# EAGLE design FinalSchematic1.2 (EAGLE 9.6.2)

## Sheet 1 of 6: Microcontroller
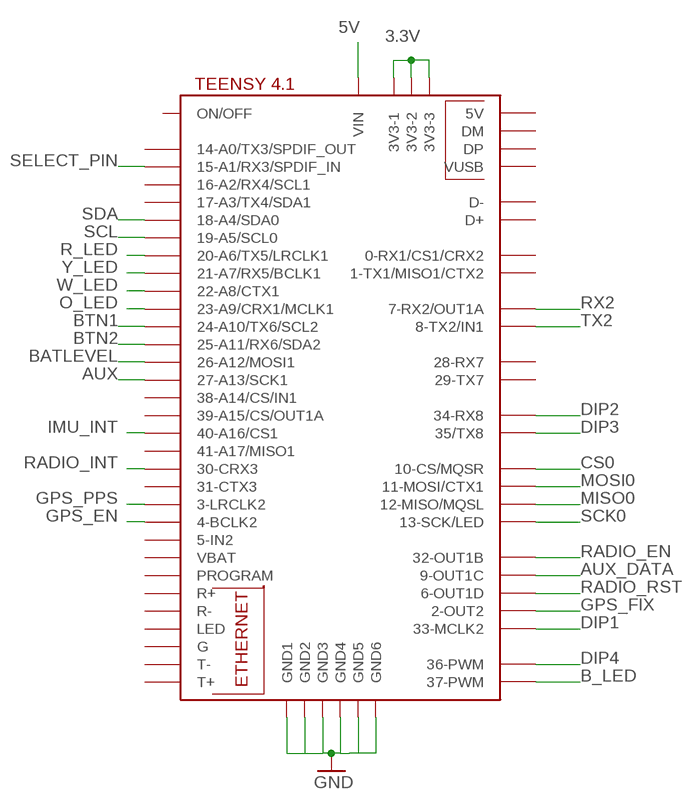
[diagram p0: schematic, sheet 1]

### Parts
TEENSY4.1  TEENSY41  [TEENSY41]

### Nets
3.3V: TEENSY4.1.3V3-1 TEENSY4.1.3V3-2 TEENSY4.1.3V3-3 ; also sheet 3
5V: TEENSY4.1.VIN ; also sheet 2,3,4,5,6
AUX: TEENSY4.1.27-A13/SCK1 ; also sheet 5
AUX_DATA: TEENSY4.1.9-OUT1C
B_LED: TEENSY4.1.37-PWM ; also sheet 5
BATLEVEL: TEENSY4.1.26-A12/MOSI1 ; also sheet 3
BTN1: TEENSY4.1.24-A10/TX6/SCL2 ; also sheet 5
BTN2: TEENSY4.1.25-A11/RX6/SDA2 ; also sheet 5
CS0: TEENSY4.1.10-CS\MQSR(10-CS/MQSR) ; also sheet 4
DIP1: TEENSY4.1.33-MCLK2 ; also sheet 5
DIP2: TEENSY4.1.34-RX8 ; also sheet 5
DIP3: TEENSY4.1.35-TX8(35/TX8) ; also sheet 5
DIP4: TEENSY4.1.36-PWM ; also sheet 5
GND: TEENSY4.1.GND1 TEENSY4.1.GND2 TEENSY4.1.GND3 TEENSY4.1.GND4 TEENSY4.1.GND5 TEENSY4.1.GND6 ; also sheet 2,3,4,5
GPS_EN: TEENSY4.1.4-BCLK2 ; also sheet 4
GPS_FIX: TEENSY4.1.2-OUT2 ; also sheet 4
GPS_PPS: TEENSY4.1.3-LRCLK2 ; also sheet 4
IMU_INT: TEENSY4.1.40-A16/CS1 ; also sheet 4
MISO0: TEENSY4.1.12-MISO/MQSL ; also sheet 4
MOSI0: TEENSY4.1.11-MOSI/CTX1 ; also sheet 4
O_LED: TEENSY4.1.23-A9/CRX1/MCLK1 ; also sheet 5
R_LED: TEENSY4.1.20-A6/TX5/LRCLK1 ; also sheet 5
RADIO_EN: TEENSY4.1.32-OUT1B ; also sheet 4
RADIO_INT: TEENSY4.1.30-CRX3 ; also sheet 4
RADIO_RST: TEENSY4.1.6-OUT1D ; also sheet 4
RX2: TEENSY4.1.7-RX2/OUT1A ; also sheet 4
SCK0: TEENSY4.1.13-SCK/LED ; also sheet 4
SCL: TEENSY4.1.19-A5/SCL0 ; also sheet 2,4,5,6
SDA: TEENSY4.1.18-A4/SDA0 ; also sheet 2,4,5,6
SELECT_PIN: TEENSY4.1.15-A1/RX3/SPDIF_IN ; also sheet 5
TX2: TEENSY4.1.8-TX2/IN1 ; also sheet 4
W_LED: TEENSY4.1.22-A8/CTX1 ; also sheet 5
Y_LED: TEENSY4.1.21-A7/RX5/BCLK1 ; also sheet 5
Unconnected: TEENSY4.1.0-RX1/CS1/CRX2 TEENSY4.1.1-TX1/MISO1/CTX2 TEENSY4.1.5-IN2 TEENSY4.1.14-A0/TX3/SPDIF_OUT TEENSY4.1.16-A2/RX4/SCL1 TEENSY4.1.17-A3/TX4/SDA1 TEENSY4.1.28-RX7 TEENSY4.1.29-TX7 TEENSY4.1.31-CTX3 TEENSY4.1.38-A14/CS/IN1 TEENSY4.1.39-A15/CS/OUT1A TEENSY4.1.41-A17/MISO1 TEENSY4.1.+5V(5V) TEENSY4.1.D+ TEENSY4.1.D- TEENSY4.1.DM TEENSY4.1.DP TEENSY4.1.G TEENSY4.1.LED TEENSY4.1.ON/OFF TEENSY4.1.PROGRAM TEENSY4.1.R+ TEENSY4.1.R- TEENSY4.1.T+ TEENSY4.1.T- TEENSY4.1.VBAT TEENSY4.1.VUSB

## Sheet 2 of 6: Servo Driver
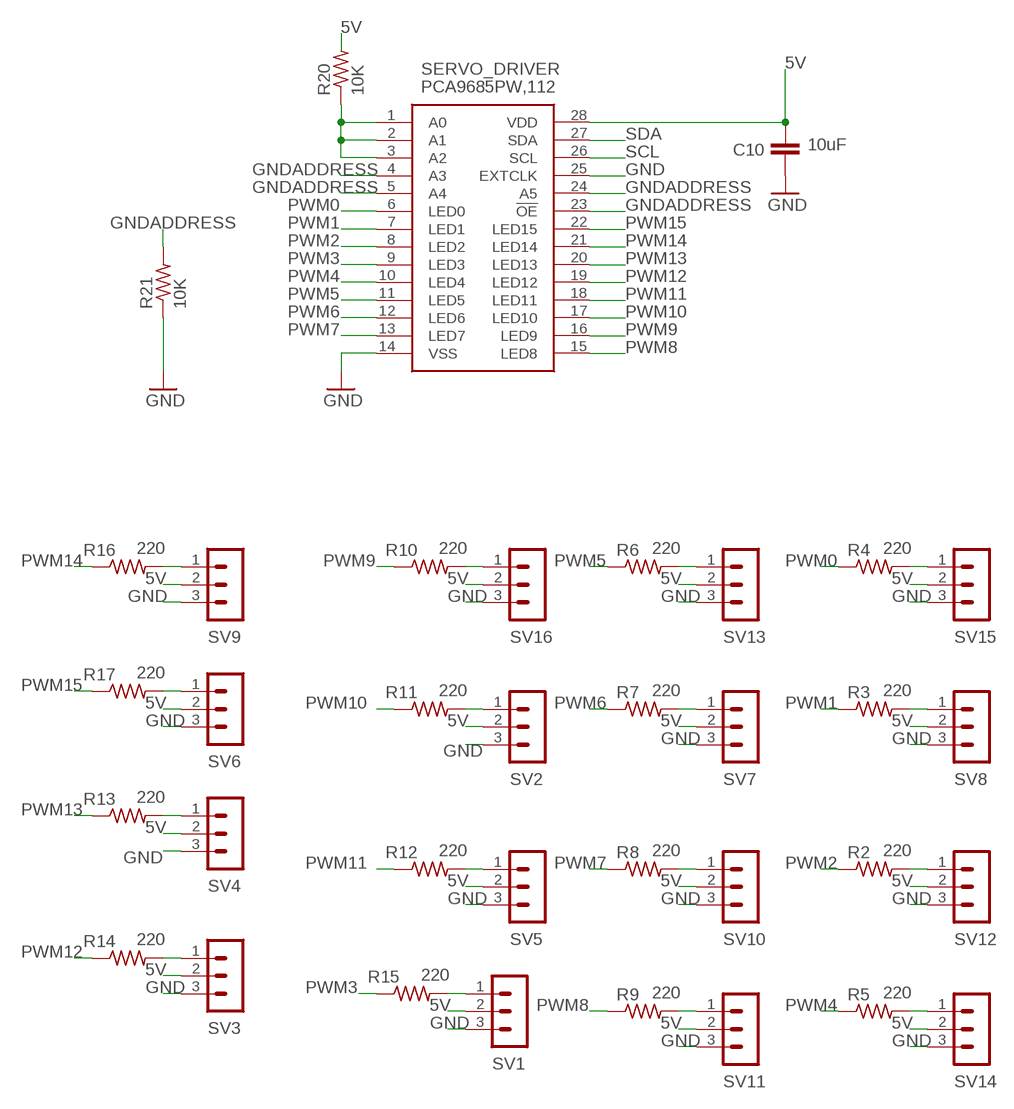
[diagram p1: schematic, sheet 2]

### Parts
C10  10uF  C2,5-3  [C2.5-3]
R2  220  R-US_0204/7  [0204/7]
R3  220  R-US_0204/7  [0204/7]
R4  220  R-US_0204/7  [0204/7]
R5  220  R-US_0204/7  [0204/7]
R6  220  R-US_0204/7  [0204/7]
R7  220  R-US_0204/7  [0204/7]
R8  220  R-US_0204/7  [0204/7]
R9  220  R-US_0204/7  [0204/7]
R10  220  R-US_0204/7  [0204/7]
R11  220  R-US_0204/7  [0204/7]
R12  220  R-US_0204/7  [0204/7]
R13  220  R-US_0204/7  [0204/7]
R14  220  R-US_0204/7  [0204/7]
R15  220  R-US_0204/7  [0204/7]
R16  220  R-US_0204/7  [0204/7]
R17  220  R-US_0204/7  [0204/7]
R20  10K  R-US_0204/7  [0204/7]
R21  10K  R-US_0204/7  [0204/7]
SERVO_DRIVER  PCA9685PW,112  [SOP65P640X110-28N]
SV1  MA03-1  [MA03-1]
SV2  MA03-1  [MA03-1]
SV3  MA03-1  [MA03-1]
SV4  MA03-1  [MA03-1]
SV5  MA03-1  [MA03-1]
SV6  MA03-1  [MA03-1]
SV7  MA03-1  [MA03-1]
SV8  MA03-1  [MA03-1]
SV9  MA03-1  [MA03-1]
SV10  MA03-1  [MA03-1]
SV11  MA03-1  [MA03-1]
SV12  MA03-1  [MA03-1]
SV13  MA03-1  [MA03-1]
SV14  MA03-1  [MA03-1]
SV15  MA03-1  [MA03-1]
SV16  MA03-1  [MA03-1]

### Nets
5V: C10.1 R20.2 SERVO_DRIVER.28(VDD) SV1.2 SV2.2 SV3.2 SV4.2 SV5.2 SV6.2 SV7.2 SV8.2 SV9.2 SV10.2 SV11.2 SV12.2 SV13.2 SV14.2 SV15.2 SV16.2 ; also sheet 1,3,4,5,6
GND: C10.2 R21.1 SERVO_DRIVER.14(VSS) SERVO_DRIVER.25(EXTCLK) SV1.3 SV2.3 SV3.3 SV4.3 SV5.3 SV6.3 SV7.3 SV8.3 SV9.3 SV10.3 SV11.3 SV12.3 SV13.3 SV14.3 SV15.3 SV16.3 ; also sheet 1,3,4,5
GNDADDRESS: R21.2 SERVO_DRIVER.4(A3) SERVO_DRIVER.5(A4) SERVO_DRIVER.23(!OE) SERVO_DRIVER.24(A5)
N$1: R20.1 SERVO_DRIVER.1(A0) SERVO_DRIVER.2(A1) SERVO_DRIVER.3(A2)
N$2: R14.2 SV3.1
N$43: R10.2 SV16.1
N$81: R6.2 SV13.1
N$82: R4.2 SV15.1
N$85: R3.2 SV8.1
N$88: R7.2 SV7.1
N$91: R11.2 SV2.1
N$94: R15.2 SV1.1
N$97: R2.2 SV12.1
N$100: R5.2 SV14.1
N$105: R9.2 SV11.1
N$108: R8.2 SV10.1
N$109: R12.2 SV5.1
N$112: R16.2 SV9.1
N$115: R17.2 SV6.1
N$118: R13.2 SV4.1
PWM0: R4.1 SERVO_DRIVER.6(LED0)
PWM1: R3.1 SERVO_DRIVER.7(LED1)
PWM2: R2.1 SERVO_DRIVER.8(LED2)
PWM3: R15.1 SERVO_DRIVER.9(LED3)
PWM4: R5.1 SERVO_DRIVER.10(LED4)
PWM5: R6.1 SERVO_DRIVER.11(LED5)
PWM6: R7.1 SERVO_DRIVER.12(LED6)
PWM7: R8.1 SERVO_DRIVER.13(LED7)
PWM8: R9.1 SERVO_DRIVER.15(LED8)
PWM9: R10.1 SERVO_DRIVER.16(LED9)
PWM10: R11.1 SERVO_DRIVER.17(LED10)
PWM11: R12.1 SERVO_DRIVER.18(LED11)
PWM12: R14.1 SERVO_DRIVER.19(LED12)
PWM13: R13.1 SERVO_DRIVER.20(LED13)
PWM14: R16.1 SERVO_DRIVER.21(LED14)
PWM15: R17.1 SERVO_DRIVER.22(LED15)
SCL: SERVO_DRIVER.26(SCL) ; also sheet 1,4,5,6
SDA: SERVO_DRIVER.27(SDA) ; also sheet 1,4,5,6

## Sheet 3 of 6: Voltage regulation
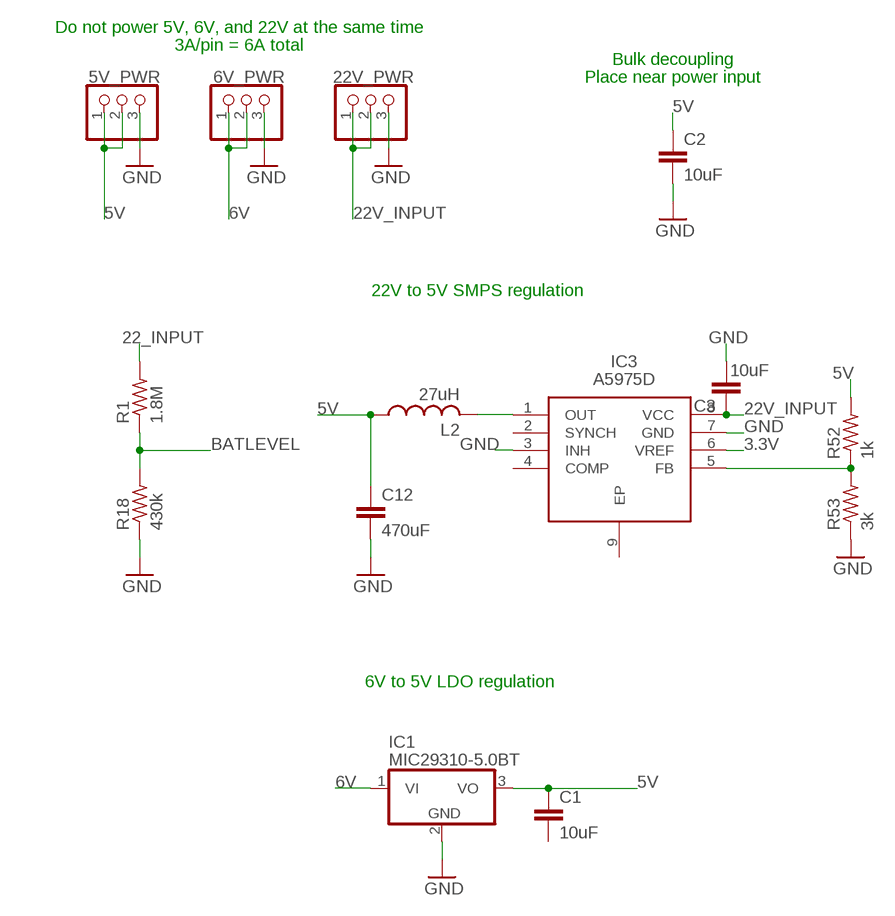
[diagram p2: schematic, sheet 3]

### Parts
5V_PWR  PINHD-1X3  [1X03]
6V_PWR  PINHD-1X3  [1X03]
22V_PWR  PINHD-1X3  [1X03]
C1  10uF  C2,5-3  [C2.5-3]
C2  10uF  C2,5-3  [C2.5-3]
C3  10uF  C2,5-3  [C2.5-3]
C12  470uF  C2,5-3  [C2.5-3]
IC1  MIC29310-5.0BT  786TV  [TO220V]
IC3  A5975D  [SOIC127P600X170-9N]
L2  27uH  L-USTFI0307  [TFI0307]
R1  1.8M  R-US_0204/7  [0204/7]
R18  430k  R-US_0204/7  [0204/7]
R52  1k  R-US_0204/7  [0204/7]
R53  3k  R-US_0204/7  [0204/7]

### Nets
3.3V: IC3.6(VREF) ; also sheet 1
5V: 5V_PWR.1 5V_PWR.2 C1.1 C2.1 C12.1 IC1.3(VO) L2.1 R52.2 ; also sheet 1,2,4,5,6
6V: 6V_PWR.1 6V_PWR.2 IC1.1(VI) ; also sheet 6
22_INPUT: R1.2
22V_INPUT: 22V_PWR.1 22V_PWR.2 C3.1 IC3.8(VCC) ; also sheet 6
BATLEVEL: R1.1 R18.2 ; also sheet 1
GND: 5V_PWR.3 6V_PWR.3 22V_PWR.3 C2.2 C3.2 C12.2 IC1.2(GND) IC3.3(INH) IC3.7(GND) R18.1 R53.1 ; also sheet 1,2,4,5
N$6: IC3.1(OUT) L2.2
N$18: IC3.5(FB) R52.1 R53.2
Unconnected: C1.2 IC3.2(SYNCH) IC3.4(COMP) IC3.9(EP)

### Notes on the sheet
- Do not power 5V, 6V, and 22V at the same time
- 3A/pin = 6A total
- Bulk decoupling
- Place near power input
- 22V to 5V SMPS regulation
- 6V to 5V LDO regulation

## Sheet 4 of 6: Sensors
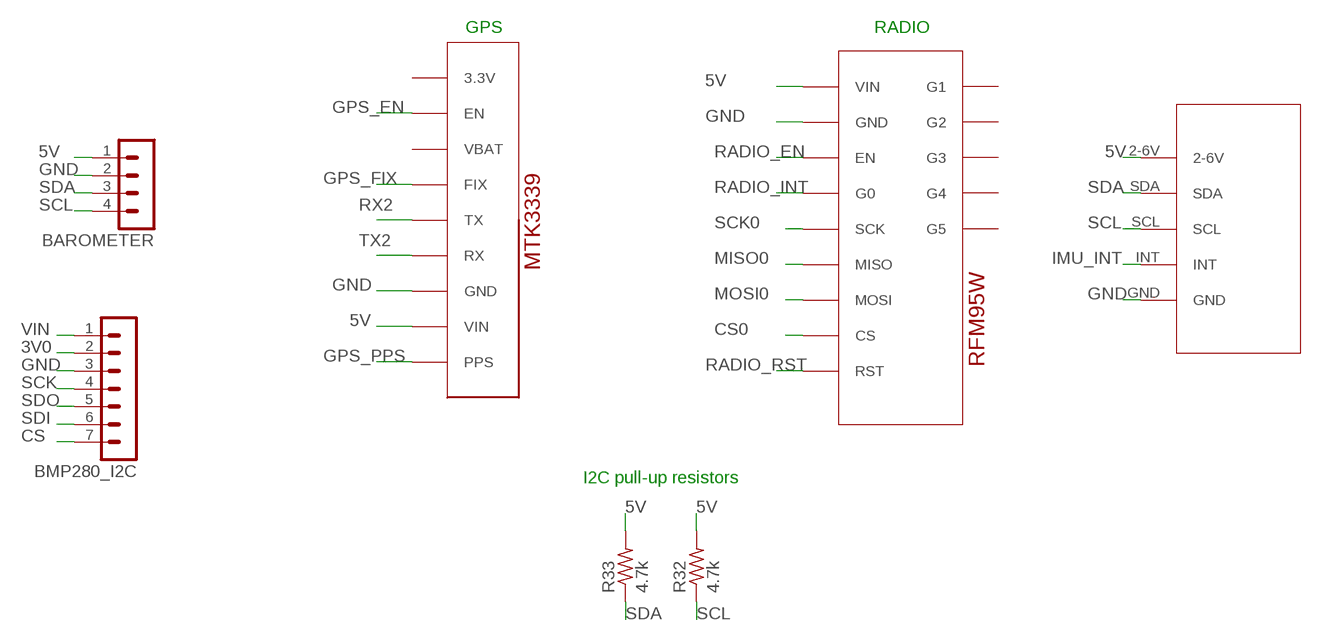
[diagram p3: schematic, sheet 4]

### Parts
BAROMETER  MA04-1  [MA04-1]
BMP280_I2C  MA07-1  [MA07-1]
GPSMTK3339  ADAFRUIT_MTK3339_GPS  [ADAFRUIT_MTK3339_GPS]
IMU  ICM20948BREAKOUTDEVICE  [ICM20948BREAKOUT]
R32  4.7k  R-US_0204/7  [0204/7]
R33  4.7k  R-US_0204/7  [0204/7]
RADIO  ADAFRUIT_RFM95W_LORA_RADIO  [ADAFRUIT_RFM95W_LORA_RADIO]

### Nets
3V0: BMP280_I2C.2
5V: BAROMETER.1 GPSMTK3339.VIN IMU.2-6V R32.2 R33.2 RADIO.1(VIN) ; also sheet 1,2,3,5,6
CS: BMP280_I2C.7
CS0: RADIO.8(CS) ; also sheet 1
GND: BAROMETER.2 BMP280_I2C.3 GPSMTK3339.GND IMU.GND RADIO.2(GND) ; also sheet 1,2,3,5
GPS_EN: GPSMTK3339.EN ; also sheet 1
GPS_FIX: GPSMTK3339.FIX ; also sheet 1
GPS_PPS: GPSMTK3339.PPS ; also sheet 1
IMU_INT: IMU.INT ; also sheet 1
MISO0: RADIO.6(MISO) ; also sheet 1
MOSI0: RADIO.7(MOSI) ; also sheet 1
RADIO_EN: RADIO.3(EN) ; also sheet 1
RADIO_INT: RADIO.4(G0) ; also sheet 1
RADIO_RST: RADIO.9(RST) ; also sheet 1
RX2: GPSMTK3339.TX ; also sheet 1
SCK: BMP280_I2C.4
SCK0: RADIO.5(SCK) ; also sheet 1
SCL: BAROMETER.4 IMU.SCL R32.1 ; also sheet 1,2,5,6
SDA: BAROMETER.3 IMU.SDA R33.1 ; also sheet 1,2,5,6
SDI: BMP280_I2C.6
SDO: BMP280_I2C.5
TX2: GPSMTK3339.RX ; also sheet 1
VIN: BMP280_I2C.1
Unconnected: GPSMTK3339.3.3V GPSMTK3339.VBAT RADIO.10(G1) RADIO.11(G2) RADIO.12(G3) RADIO.13(G4) RADIO.14(G5)

### Notes on the sheet
- GPS | RADIO
- I2C pull-up resistors

## Sheet 5 of 6: External Connectors
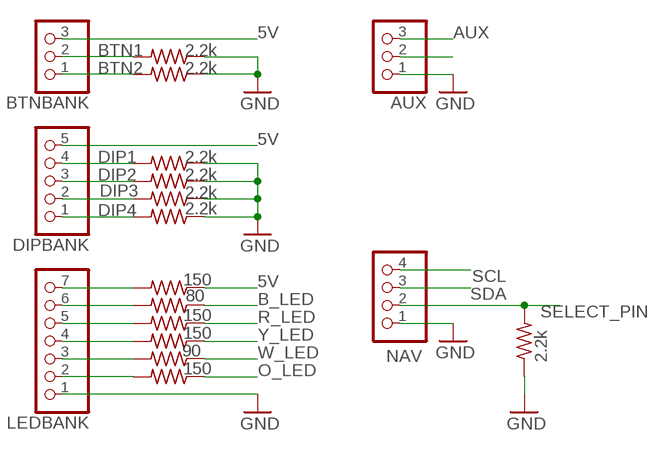
[diagram p4: schematic, sheet 5]

### Parts
AUX  PINHD-1X3  [1X03]
BLUE  80  R-US_0204/7  [0204/7]
BTNBANK  PINHD-1X3  [1X03]
DIPBANK  PINHD-1X5  [1X05]
GREEN  150  R-US_0204/7  [0204/7]
LEDBANK  PINHD-1X7  [1X07]
NAV  PINHD-1X4  [1X04]
ORANGE  150  R-US_0204/7  [0204/7]
R19  2.2k  R-US_0204/7  [0204/7]
R22  2.2k  R-US_0204/7  [0204/7]
R23  2.2k  R-US_0204/7  [0204/7]
R34  2.2k  R-US_0204/7  [0204/7]
R35  2.2k  R-US_0204/7  [0204/7]
R36  2.2k  R-US_0204/7  [0204/7]
R37  2.2k  R-US_0204/7  [0204/7]
RED  150  R-US_0204/7  [0204/7]
WHITE  90  R-US_0204/7  [0204/7]
YELLOW  150  R-US_0204/7  [0204/7]

### Nets
5V: BTNBANK.3 DIPBANK.5 GREEN.1 ; also sheet 1,2,3,4,6
AUX: AUX.3 ; also sheet 1
B_LED: BLUE.1 ; also sheet 1
BLUE: BLUE.2 LEDBANK.6
BTN1: BTNBANK.2 R19.2 ; also sheet 1
BTN2: BTNBANK.1 R22.2 ; also sheet 1
DIP1: DIPBANK.4 R37.2 ; also sheet 1
DIP2: DIPBANK.3 R36.2 ; also sheet 1
DIP3: DIPBANK.2 R34.2 ; also sheet 1
DIP4: DIPBANK.1 R35.2 ; also sheet 1
GND: AUX.1 LEDBANK.1 NAV.1 R19.1 R22.1 R23.1 R34.1 R35.1 R36.1 R37.1 ; also sheet 1,2,3,4
GREEN: GREEN.2 LEDBANK.7
N$4: AUX.2
O_LED: ORANGE.1 ; also sheet 1
ORANGE: LEDBANK.2 ORANGE.2
R_LED: RED.1 ; also sheet 1
RED: LEDBANK.5 RED.2
SCL: NAV.4 ; also sheet 1,2,4,6
SDA: NAV.3 ; also sheet 1,2,4,6
SELECT_PIN: NAV.2 R23.2 ; also sheet 1
W_LED: WHITE.1 ; also sheet 1
WHITE: LEDBANK.3 WHITE.2
Y_LED: YELLOW.1 ; also sheet 1
YELLOW: LEDBANK.4 YELLOW.2

## Sheet 6 of 6: Test Points
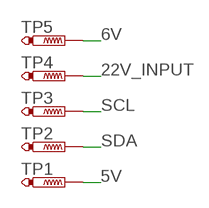
[diagram p5: schematic, sheet 6]

### Parts
TP1  PTR1B1,27  [B1,27]
TP2  PTR1B1,27  [B1,27]
TP3  PTR1B1,27  [B1,27]
TP4  PTR1B1,27  [B1,27]
TP5  PTR1B1,27  [B1,27]

### Nets
5V: TP1.TP ; also sheet 1,2,3,4,5
6V: TP5.TP ; also sheet 3
22V_INPUT: TP4.TP ; also sheet 3
SCL: TP3.TP ; also sheet 1,2,4,5
SDA: TP2.TP ; also sheet 1,2,4,5

## Library data of the parts
5V_PWR 6V_PWR 22V_PWR AUX BTNBANK = pinhead:PINHD-1X3: PIN HEADER
BAROMETER = con-lstb:MA04-1: PIN HEADER; OC_FARNELL: unknown; OC_NEWARK: unknown
BLUE GREEN ORANGE R1-R23 R32-R37 R52 R53 RED WHITE YELLOW = adafruit:R-US_: RESISTOR, American symbol
BMP280_I2C = con-lstb:MA07-1: PIN HEADER; OC_FARNELL: unknown; OC_NEWARK: unknown
C1-C3 C10 C12 = capacitor-wima:C: CAPACITOR naming: grid - package width
DIPBANK = pinhead:PINHD-1X5: PIN HEADER
GPSMTK3339 = AERO_Eagle_Library:ADAFRUIT_MTK3339_GPS: Adafruit's Ultimate GPS Breakout: MTK3339 https://www.adafruit.com/product/746
IC1 = linear:78*: Positive VOLTAGE REGULATOR Source: http://cache.national.com/ds/LM/LM78L05.pdf http://www.fairchildsemi.com/ds/LM/LM7805.pdf
IC3 = A5975D:A5975D: STMICROELECTRONICS - A5975D - DC/DC Boost Regulator, Adjustable, AEC-Q100, 4V to 36V In, 1.235V to 35V/3A Out, 250 kHz, PowerSO-8 Source: Datasheet <https://www.st.com/resource/en/datasheet/a5975d.pdf>; ARROW_PART_NUMBER: A5975D; ARROW_PRICE-STOCK: https://www.arrow.com/en/products/a5975d/stmicroelectronics; DESCRIPTION: STMICROELECTRONICS - A5975D - DC/DC Boost Regulator, Adjustable, AEC-Q100, 4V to 36V In, 1.235V to 35V/3A Out, 250 kHz, PowerSO-8; HEIGHT: 1.7mm; MANUFACTURER_NAME: STMicroelectronics; MANUFACTURER_PART_NUMBER: A5975D; MOUSER_PART_NUMBER: 511-A5975D; MOUSER_PRICE-STOCK: https://www.mouser.co.uk/ProductDetail/STMicroelectronics/A5975D?qs=LYO3r17CQdO66PebjUe%2FOA%3D%3D
IMU = ICM20948 BREAKOUT:ICM20948BREAKOUTDEVICE; SPICEPREFIX: X
L2 = rcl:L-US: INDUCTOR, American symbol; SPICEPREFIX: L
LEDBANK = pinhead:PINHD-1X7: PIN HEADER
NAV = pinhead:PINHD-1X4: PIN HEADER
RADIO = AERO_Eagle_Library:ADAFRUIT_RFM95W_LORA_RADIO: Adafruit's LoRa Radio: RFM95W https://www.adafruit.com/product/3072
SERVO_DRIVER = PCA9685PW_112:PCA9685PW,112: 16-channel, 12-bit PWM Fm+ I2C-bus LED controller Source: Datasheet <http://www.nxp.com/docs/en/data-sheet/PCA9685.pdf>; ARROW_PART_NUMBER: PCA9685PW,112; ARROW_PRICE-STOCK: https://www.arrow.com/en/products/pca9685pw112/nxp-semiconductors; DESCRIPTION: 16-channel, 12-bit PWM Fm+ I2C-bus LED controller; HEIGHT: 1.1mm; MANUFACTURER_NAME: NXP; MANUFACTURER_PART_NUMBER: PCA9685PW,112; MOUSER_PART_NUMBER: 771-PCA9685PW,112; MOUSER_PRICE-STOCK: https://www.mouser.co.uk/ProductDetail/NXP-Semiconductors/PCA9685PW112/?qs=6YAT8rHPFU9wZqiAeiOMZw%3D%3D
SV1-SV16 = con-lstb:MA03-1: PIN HEADER; OC_FARNELL: unknown; OC_NEWARK: unknown
TEENSY4.1 = teensy:TEENSY41
TP1-TP5 = testpad:PTR1: TEST PIN

## Board
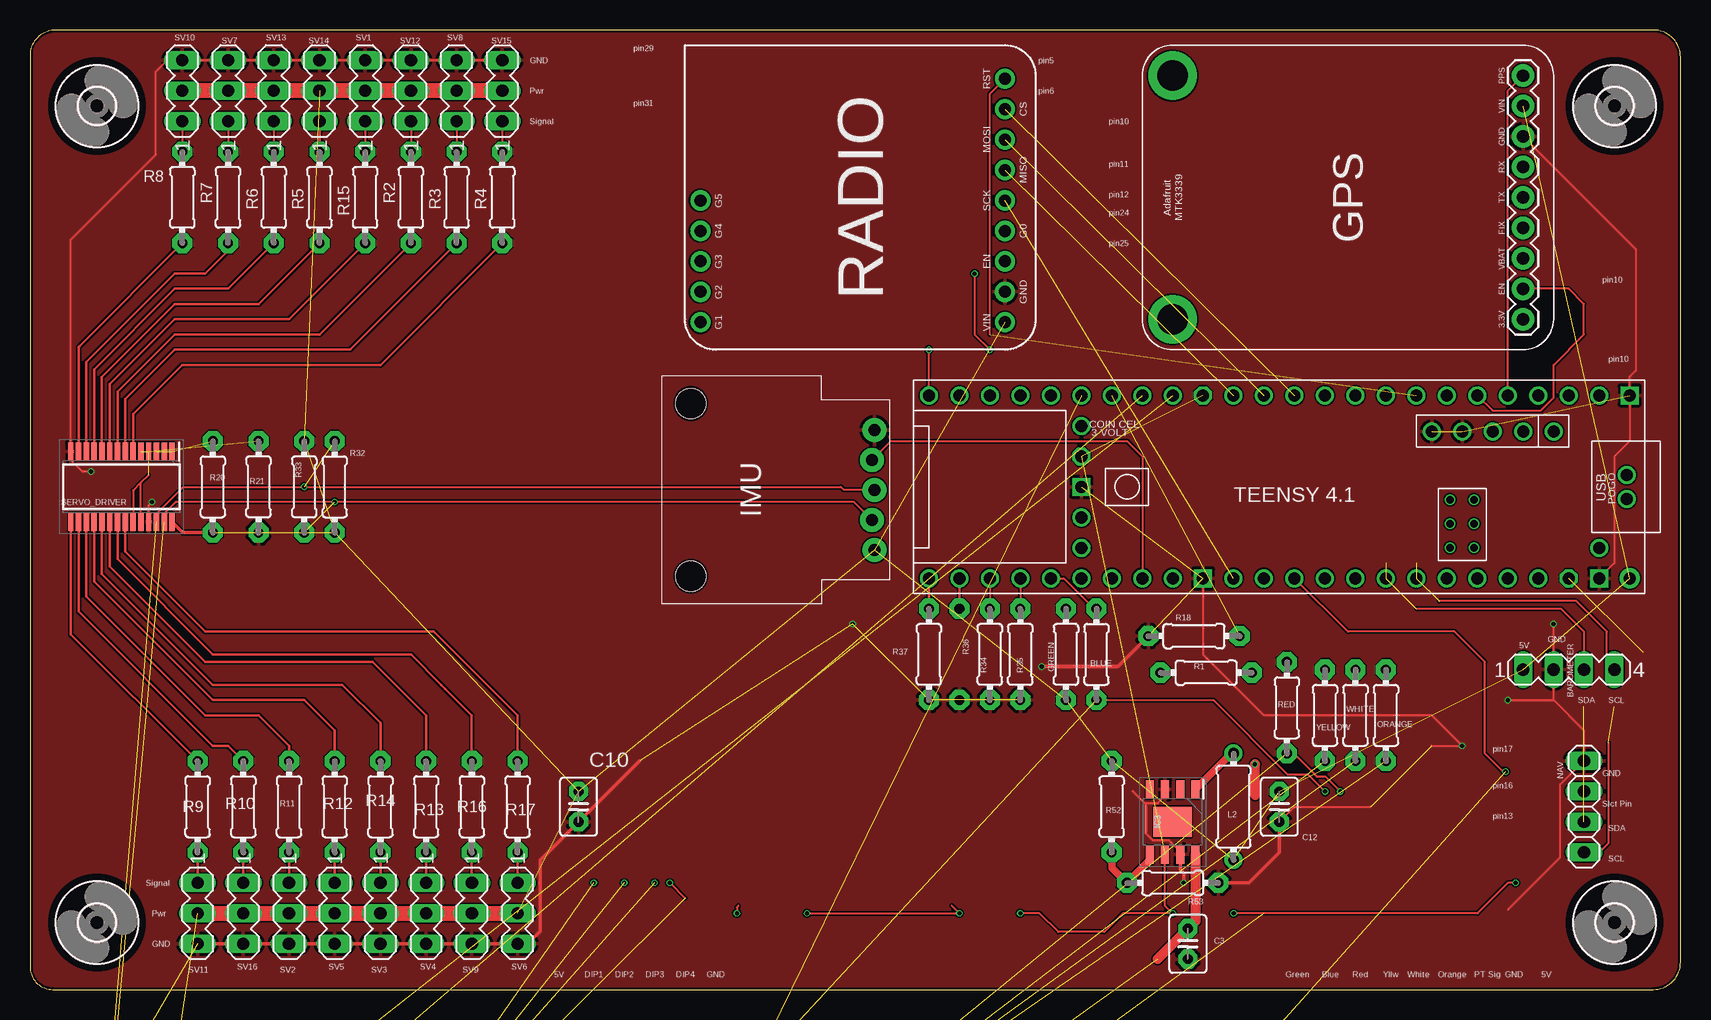
[diagram p6: board, top side]
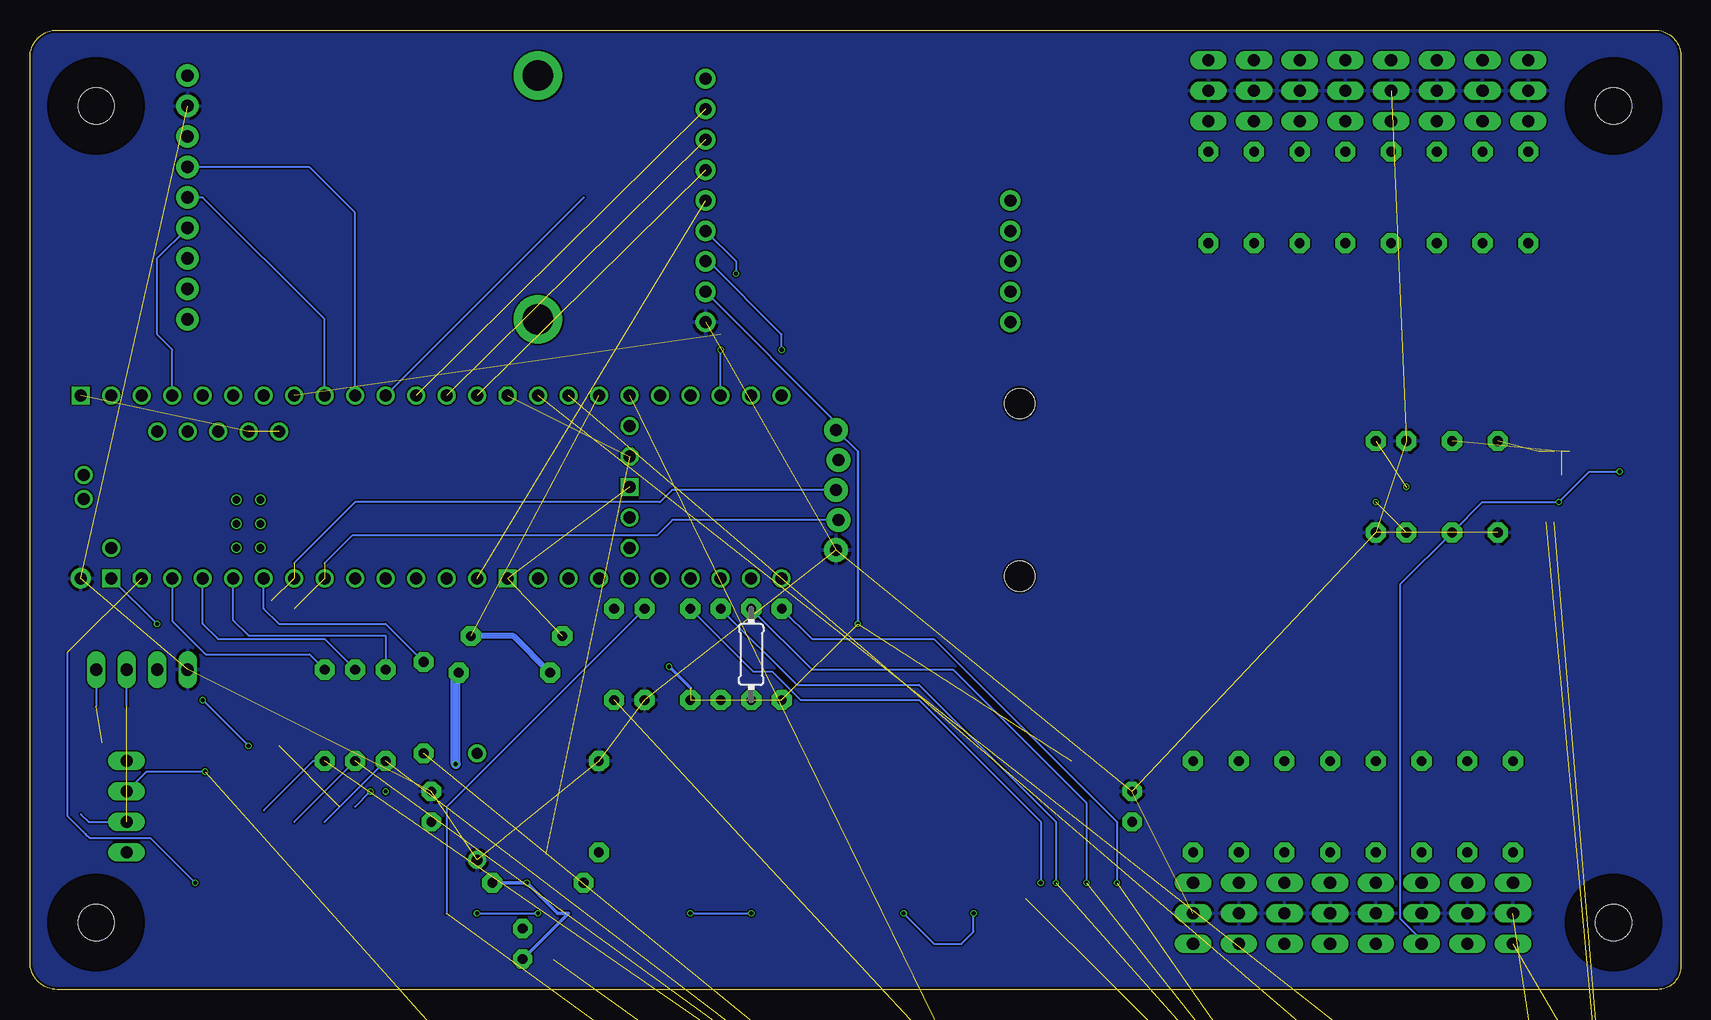
[diagram p7: board, bottom side, seen from below]

Size 137.59 x 80 mm. Coordinates in mm from the lower left corner, seen from the top.
Outline: 1.91,0 135.31,0 arc90 137.59,2.29 137.59,77.71 arc90 135.31,80 2.21,80 arc45 0.59,79.33 arc45 0,77.91 0,1.91 arc90 1.91,0
Copper layers (1*16): Top 0.035559375mm / dielectric 1.6mm / Bottom 0.035559375mm
Design rules "jlcpcb2layer": minimum track width 5mil, minimum drill 12mil, track to track 5mil, track to pad 5mil, pad to pad 5mil, via to via 5mil, smd to smd 5mil, copper to edge 8mil, drill to drill 6mil, minimum pad ring 5mil, minimum via ring 3mil, stop-mask expansion 2.5mil, vias tented up to drill 0mil, thermal gap 10mil

### Footprints (pad centres in the part's own frame; a part is rotated, then mirrored left to right if it is on the bottom)
1X03 = drill 1.016 long: 1 -2.54,0; 2 0,0; 3 2.54,0
MA04-1 = drill 1.016 long: 1 -3.81,0; 2 -1.27,0; 3 1.27,0; 4 3.81,0
0204/7 = drill 0.813 pad 1.676 octagon: 1 -3.81,0; 2 3.81,0
MA07-1 = drill 1.016 long: 1 -7.62,0; 2 -5.08,0; 3 -2.54,0; 4 0,0; 5 2.54,0; 6 5.08,0; 7 7.62,0
C2.5-3 = drill 0.813 pad 1.6 octagon: 1 -1.27,0; 2 1.27,0
1X05 = drill 1.016 long: 1 -5.08,0; 2 -2.54,0; 3 0,0; 4 2.54,0; 5 5.08,0
ADAFRUIT_MTK3339_GPS = drill 1.016 pad 1.88: 3.3V 2.54,2.54; EN 5.08,2.54; FIX 10.16,2.54; GND 17.78,2.54; PPS 22.86,2.54; RX 15.24,2.54; TX 12.7,2.54; VBAT 7.62,2.54; VIN 20.32,2.54 | drill 2.54 pad 4.064: P$1 22.86,31.75; P$2 2.54,31.75
TO220V = drill 1.016 long: 1 -2.54,-2.54; 2 0,-2.54; 3 2.54,-2.54
SOIC127P600X170-9N = smd 1.525 x 0.65: 1 -2.712,1.905; 2 -2.712,0.635; 3 -2.712,-0.635; 4 -2.712,-1.905; 5 2.712,-1.905; 6 2.712,-0.635; 7 2.712,0.635; 8 2.712,1.905 | smd 2.51 x 3.2: 9 0,0
ICM20948BREAKOUT = drill 1 pad 2: 2-6V -5.254,-9.427; GND 4.746,-9.427; INT 2.246,-9.227; SCL -0.254,-9.427; SDA -2.754,-9.227 | hole 2.5: -7.454,5.873; 6.946,5.873
TFI0307 = drill 0.9 pad 1.5: 1 -4.445,0; 2 4.445,0
1X07 = drill 1.016 long: 1 -7.62,0; 2 -5.08,0; 3 -2.54,0; 4 0,0; 5 2.54,0; 6 5.08,0; 7 7.62,0
1X04 = drill 1.016 long: 1 -3.81,0; 2 -1.27,0; 3 1.27,0; 4 3.81,0
ADAFRUIT_RFM95W_LORA_RADIO = drill 1 pad 1.676: 1 2.29,-26.67; 2 4.83,-26.67; 3 7.37,-26.67; 4 9.91,-26.67; 5 12.45,-26.67; 6 14.99,-26.67; 7 17.53,-26.67; 8 20.07,-26.67; 9 22.61,-26.67; 10 2.29,-1.27; 11 4.83,-1.27; 12 7.37,-1.27; 13 9.91,-1.27; 14 12.45,-1.27
SOP65P640X110-28N = smd 1.475 x 0.45: 1 -2.938,4.225; 2 -2.938,3.575; 3 -2.938,2.925; 4 -2.938,2.275; 5 -2.938,1.625; 6 -2.938,0.975; 7 -2.938,0.325; 8 -2.938,-0.325; 9 -2.938,-0.975; 10 -2.938,-1.625; 11 -2.938,-2.275; 12 -2.938,-2.925; 13 -2.938,-3.575; 14 -2.938,-4.225; 15 2.938,-4.225; 16 2.938,-3.575; 17 2.938,-2.925; 18 2.938,-2.275; 19 2.938,-1.625; 20 2.938,-0.975; 21 2.938,-0.325; 22 2.938,0.325; 23 2.938,0.975; 24 2.938,1.625; 25 2.938,2.275; 26 2.938,2.925; 27 2.938,3.575; 28 2.938,4.225
MA03-1 = drill 1.016 long: 1 -2.54,0; 2 0,0; 3 2.54,0
TEENSY41 = drill 1: 0-RX1/CS1/CRX2 -27.94,-7.62; 1-TX1/MISO1/CTX2 -25.4,-7.62; 2-OUT2 -22.86,-7.62; 3-LRCLK2 -20.32,-7.62; 4-BCLK2 -17.78,-7.62; 5-IN2 -15.24,-7.62; 6-OUT1D -12.7,-7.62; 7-RX2/OUT1A -10.16,-7.62; 8-TX2/IN1 -7.62,-7.62; 9-OUT1C -5.08,-7.62; 10-CS\MQSR -2.54,-7.62; 11-MOSI/CTX1 0,-7.62; 12-MISO/MQSL 2.54,-7.62; 13-SCK/LED 2.54,7.62; 14-A0/TX3/SPDIF_OUT 0,7.62; 15-A1/RX3/SPDIF_IN -2.54,7.62; 16-A2/RX4/SCL1 -5.08,7.62; 17-A3/TX4/SDA1 -7.62,7.62; 18-A4/SDA0 -10.16,7.62; 19-A5/SCL0 -12.7,7.62; 20-A6/TX5/LRCLK1 -15.24,7.62; 21-A7/RX5/BCLK1 -17.78,7.62; 22-A8/CTX1 -20.32,7.62; 23-A9/CRX1/MCLK1 -22.86,7.62; 24-A10/TX6/SCL2 7.62,-7.62; 25-A11/RX6/SDA2 10.16,-7.62; 26-A12/MOSI1 12.7,-7.62; 27-A13/SCK1 15.24,-7.62; 28-RX7 17.78,-7.62; 29-TX7 20.32,-7.62; 30-CRX3 22.86,-7.62; 31-CTX3 25.4,-7.62; 32-OUT1B 27.94,-7.62; 33-MCLK2 27.94,7.62; 34-RX8 25.4,7.62; 35-TX8 22.86,7.62; 36-PWM 20.32,7.62; 37-PWM 17.78,7.62; 38-A14/CS/IN1 15.24,7.62; 39-A15/CS/OUT1A 12.7,7.62; 40-A16/CS1 10.16,7.62; 41-A17/MISO1 7.62,7.62; +5V -24.13,-4.62; D+ -30.25,-1; D- -30.25,1; DM -21.59,-4.62; DP -19.05,-4.62; GND4 -16.51,-4.62; GND5 -13.97,-4.62; ON/OFF 15.24,5.08; PROGRAM 15.24,2.54; VBAT 15.24,-5.08; VUSB -27.94,5.08 | drill 1 octagon: 3V3-1 5.08,-7.62; 3V3-2 15.24,-2.54; 3V3-3 -25.4,7.62 | drill 0.6: G -15.51,3.08; LED -17.51,3.08; R+ -17.51,5.08; R- -15.51,5.08; T+ -15.51,1.08; T- -17.51,1.08 | drill 1 square: GND1 -30.48,-7.62; GND2 15.24,0; GND3 5.08,7.62; GND6 -27.94,7.62 | drill 1 pad 1.676: VIN -30.48,7.62
B1,27 = smd 1.27 x 1.27: TP 0,0
3,0 = hole 3: 0,0

### Placement (x,y rotation side)
5V_PWR  4.57,-89.41 0 top  (outside the outline)
6V_PWR  4.57,-50.29 0 top  (outside the outline)
22V_PWR  4.57,-61.47 0 top  (outside the outline)
AUX  4.57,-115.32 0 top  (outside the outline)
BAROMETER  128.27,26.67 0 top
BLUE  88.9,27.94 270 top
BMP280_I2C  9.65,-128.02 0 top  (outside the outline)
BTNBANK  4.57,-39.12 0 top  (outside the outline)
C1  2.54,-103.63 0 top  (outside the outline)
C2  2.54,-120.9 0 top  (outside the outline)
C3  96.52,3.81 270 top
C10  45.72,15.24 270 top
C12  104.14,15.24 270 top
DIPBANK  7.11,-44.7 0 top  (outside the outline)
GPSMTK3339  127,53.34 90 top
GREEN  86.36,27.94 90 top
IC1  MIC2937A-5.0BT  [TO220V]  5.59,-91.44 0 top  (outside the outline)
IC3  95.25,13.97 270 top
IMU  60.96,41.91 90 top
L2  100.33,15.24 90 top
LEDBANK  9.65,-55.88 0 top  (outside the outline)
NAV  129.54,15.24 270 top
ORANGE  113.03,22.86 270 top
R1  98.04,26.42 0 top
R2  31.75,66.04 90 top
R3  35.56,66.04 90 top
R4  39.37,66.04 90 top
R5  24.13,66.04 90 top
R6  20.32,66.04 90 top
R7  16.51,66.04 90 top
R8  12.7,66.04 90 top
R9  13.97,15.24 270 top
R10  17.78,15.24 270 top
R11  21.59,15.24 270 top
R12  25.4,15.24 270 top
R13  33.02,15.24 270 top
R14  29.21,15.24 270 top
R15  27.94,66.04 90 top
R16  36.83,15.24 270 top
R17  40.64,15.24 270 top
R18  97.03,29.46 0 top
R19  4.57,-18.8 0 top  (outside the outline)
R20  15.24,41.91 270 top
R21  19.05,41.91 90 top
R22  4.57,-22.86 0 top  (outside the outline)
R23  4.57,-110.24 0 top  (outside the outline)
R32  25.4,41.91 270 top
R33  22.86,41.91 90 top
R34  80.01,27.94 90 top
R35  82.55,27.94 90 top
R36  77.47,27.94 90 bottom
R37  74.93,27.94 90 top
R52  90.17,15.24 90 top
R53  95.25,8.89 180 top
RADIO  54.61,53.34 90 top
RED  104.78,23.5 270 top
SERVO_DRIVER  7.62,41.91 270 top
SV1  27.94,74.93 90 top
SV2  21.59,6.35 270 top
SV3  29.21,6.35 270 top
SV4  33.02,6.35 270 top
SV5  25.4,6.35 270 top
SV6  40.64,6.35 270 top
SV7  16.51,74.93 90 top
SV8  35.56,74.93 90 top
SV9  36.83,6.35 270 top
SV10  12.7,74.93 90 top
SV11  13.97,6.35 270 top
SV12  31.75,74.93 90 top
SV13  20.32,74.93 90 top
SV14  24.13,74.93 90 top
SV15  39.37,74.93 90 top
SV16  17.78,6.35 270 top
TEENSY4.1  102.87,41.91 180 top
TP1  1.02,-66.04 0 top  (outside the outline)
TP2  1.02,-70.61 0 top  (outside the outline)
TP3  1.02,-75.18 0 top  (outside the outline)
TP4  1.02,-79.76 0 top  (outside the outline)
TP5  1.02,-84.33 0 top  (outside the outline)
U$1  [3,0]  132.08,5.59 0 top
U$2  [3,0]  5.59,5.59 0 top
U$3  [3,0]  5.59,73.66 0 top
U$4  [3,0]  132.08,73.66 0 top
WHITE  110.49,22.86 270 top
YELLOW  107.95,22.86 270 top

### Tracks (layer width: path | path; a pad name or v marks a point on that pad's centre or on a via)
3.3V  (via drill 0.35)  (3 unrouted)
  Top 0.152: v100.33,6.35 120.65,6.35 123.19,8.89 v123.83,8.89 | IC3.6 94.62,6.99 v95.25,6.35 91.11,6.35 89.55,4.79 85.71,4.79 84.15,6.35 v82.55,6.35 | 76.84,6.99 v77.47,6.35 v64.77,6.35 | 59.06,6.99 58.93,6.86 v58.93,6.35
  Bottom 0.152: 134.47,28.09 134.47,14.48 133.15,13.16 132.94,12.95 132.63,12.64 127.57,12.64 v123.83,8.89 | v100.33,6.35 v95.25,6.35 | v82.55,6.35 v77.47,6.35 | v64.77,6.35 62.23,3.81 59.94,3.81 58.93,4.83 v58.93,6.35
5V  (22 unrouted)
  Top 0.305: R20.2 12.72,38.1 SERVO_DRIVER.28
  Top 0.813: SV11.2 SV16.2 SV2.2 SV5.2 SV3.2 SV4.2 SV9.2 SV6.2
  Top 1.27: SV11.2 SV6.2 | SV15.2 SV8.2 SV12.2 SV1.2 SV14.2 SV13.2 SV7.2 SV10.2
  pour Bottom: 0,1.91 0,77.72 arc-90 2.29,80.01 135.64,80.01 arc-90 137.92,77.72 137.92,2.29 arc-90 135.64,0 1.91,0 arc-90
6V  (3 unrouted)
22_INPUT  (via drill 0.35)
  Top 0.813: 102.11,16.21 v102.11,18.8
  Bottom 0.813: v102.11,18.8 102.11,26.16 R1.2
22V_INPUT  (3 unrouted)
  Top 0.813: 93.98,2.54 C3.1 97.16,5.71 IC3.8
AUX  (1 unrouted)
AUX_DATA
  Bottom 0.152: TEENSY4.1.9-OUT1C 91.44,66.04
B_LED
  Top 0.152: BLUE.1 88.71,31.75 86.17,34.29 TEENSY4.1.37-PWM
BATLEVEL  (1 unrouted)
  Bottom 0.508: R1.1 97.28,29.46 R18.2
BLUE  (via drill 0.35)  (1 unrouted)
  Top 0.152: BLUE.2 98.63,24.13 104.83,17.93 106.53,17.93 v107.95,16.51
BTN1  (2 unrouted)
BTN2  (2 unrouted)
CS0  (1 unrouted)
DIP1  (via drill 0.35)  (1 unrouted)
  Top 0.203: TEENSY4.1.33-MCLK2 R37.2
  Bottom 0.152: R37.2 72.39,29.21 62.23,29.21 46.99,13.97 v46.99,8.89
DIP2  (via drill 0.35)  (1 unrouted)
  Top 0.203: TEENSY4.1.34-RX8 R36.2
  Bottom 0.152: R36.2 72.39,26.67 60.65,26.67 49.53,15.55 v49.53,8.89
DIP3  (via drill 0.35)  (1 unrouted)
  Top 0.152: TEENSY4.1.35-TX8 R34.2
  Bottom 0.152: R34.2 73.66,25.4 63.5,25.4 52.07,13.97 v52.07,8.89
DIP4  (via drill 0.35)  (1 unrouted)
  Top 0.152: TEENSY4.1.36-PWM R35.2 | v53.34,8.89 54.61,7.62
  Bottom 0.152: R35.2 77.32,26.52 75.74,26.52 73.35,24.13 63.5,24.13 53.34,13.97 v53.34,8.89
GND  (via drill 0.35)  (22 unrouted)
  Top 0.152: v127,30.48 BAROMETER.2 127,24.13 | v123.19,24.13 127,24.13 | GPSMTK3339.GND 133.88,61.7 133.88,51.64 133.35,51.1 TEENSY4.1.GND1 133.35,45.72 132.08,44.45 132.08,35.56 TEENSY4.1.GND6 | 127,24.13 129.54,21.59 NAV.1 127.53,17.04 127.53,11 123.19,6.66 | SERVO_DRIVER.25 9.9,40.38 v10.16,40.64 | v5.08,43.18 4.36,43.18 3.4,44.14 SERVO_DRIVER.14 3.4,62.52 10.49,69.61 10.49,76.53 11.43,77.47 SV10.3 | 116.84,20.32 v119.38,20.32 116.84,22.86 102.87,22.86 97.79,27.94 TEENSY4.1.GND3 | C12.2 105.41,15.24 111.76,15.24
  Top 0.203: SV10.3 SV7.3 SV13.3 SV14.3 SV1.3 SV12.3 SV8.3 SV15.3 | 93.04,15.5 93.98,15.5 94.62,16.14 IC3.3 | IC3.7 95.89,11.47 94.92,12.44 93.61,12.44 93.04,13 93.04,15.5 | 91.95,16.51 92.95,15.5 93.04,15.5
  Top 0.305: 50.8,19.05 C10.2 42.52,10.77 42.52,4.87 41.46,3.81 SV6.3 SV9.3 SV4.3 SV3.3 SV5.3 SV2.3 SV16.3 SV11.3 | v96.17,8.89 96.17,9.71 95.89,9.99 IC3.7 | R53.1 101.6,8.89 104.14,11.43 C12.2 | R18.1 90.68,26.92 v84.33,26.92
  Bottom 0.152: TEENSY4.1.GND6 v127,30.48 | v5.08,43.18 7.62,43.18 v10.16,40.64 16.51,40.64 R21.1 23.39,33.76 23.39,5.92 21.59,4.12 SV2.3 | v123.19,24.13 v119.38,20.32
  Bottom 0.203: v68.58,30.48 68.58,44.85 IMU.GND 70.39,47.28 RADIO.2
  Bottom 0.305: R53.1 v96.17,8.89 93.63,6.35 92.71,6.35 C3.2 | v84.33,26.92 82.55,25.15
  pour Top: 0,1.91 0,77.72 arc-90 2.29,80.01 135.64,80.01 arc-90 137.92,77.72 137.92,2.29 arc-90 135.64,0 1.91,0 arc-90
GNDADDRESS  (3 unrouted)
  Top 0.152: SERVO_DRIVER.23 8.6,41.62 9.25,42.27 | SERVO_DRIVER.24 9.25,42.27 | 9.25,42.27 9.9,42.91
GPS_EN
  Top 0.152: TEENSY4.1.4-BCLK2 121.92,48.26 125.92,48.26 127,49.34 127,52.07 129.54,54.61 129.54,57.15 128.27,58.42 GPSMTK3339.EN
GPS_FIX
  Bottom 0.152: GPSMTK3339.FIX 127,60.96 127,54.61 125.73,53.34 TEENSY4.1.2-OUT2
GPS_PPS
  Top 0.152: TEENSY4.1.3-LRCLK2 123.19,74.93 GPSMTK3339.PPS
GREEN  (1 unrouted)
  Bottom 0.152: GREEN.2 102.87,15.24 102.87,6.35
IMU_INT
  Top 0.152: IMU.INT 71.75,45.72 91.44,45.72 92.71,44.45 TEENSY4.1.40-A16/CS1
MISO0  (1 unrouted)
MOSI0  (1 unrouted)
N$1  (3 unrouted)
N$2
  Top 0.203: SV3.1 R14.2
N$6
  Top 0.61: IC3.1 100.16,19.68 L2.2
N$18
  Top 0.61: IC3.5 93.34,10.79 R53.2 90.17,10.16 R52.1
N$43
  Top 0.203: SV16.1 R10.2
N$81
  Top 0.152: SV13.1 R6.2
N$82
  Top 0.152: SV15.1 R4.2
N$85
  Top 0.152: SV8.1 R3.2
N$88
  Top 0.152: SV7.1 R7.2
N$91
  Top 0.203: SV2.1 R11.2
N$94
  Top 0.152: SV1.1 R15.2
N$97
  Top 0.152: SV12.1 R2.2
N$100
  Top 0.152: SV14.1 R5.2
N$105
  Top 0.203: SV11.1 R9.2
N$108
  Top 0.152: SV10.1 R8.2
N$109
  Top 0.203: SV5.1 R12.2
N$112
  Top 0.203: SV9.1 R16.2
N$115
  Top 0.203: SV6.1 R17.2
N$118
  Top 0.203: SV4.1 R13.2
O_LED
  Bottom 0.152: TEENSY4.1.23-A9/CRX1/MCLK1 125.73,30.73 122.94,27.94 114.3,27.94 ORANGE.1
ORANGE  (1 unrouted)
  Bottom 0.152: 118.11,14.93 113.99,19.05 ORANGE.2
PWM0
  Top 0.203: R4.1 29.21,52.07 12.7,52.07 8.6,47.97 SERVO_DRIVER.6
PWM1
  Top 0.203: SERVO_DRIVER.7 7.95,49.22 12.07,53.34 26.67,53.34 R3.1
PWM2
  Top 0.203: SERVO_DRIVER.8 7.3,49.84 12.07,54.61 24.13,54.61 R2.1
PWM3
  Top 0.203: SERVO_DRIVER.9 6.65,50.46 12.07,55.88 21.59,55.88 R15.1
PWM4
  Top 0.203: SERVO_DRIVER.10 6,51.08 12.07,57.15 19.05,57.15 R5.1
PWM5
  Top 0.203: SERVO_DRIVER.11 5.35,51.7 12.07,58.42 16.51,58.42 R6.1
PWM6
  Top 0.203: SERVO_DRIVER.12 4.7,52.32 12.07,59.69 14.61,59.69 16.51,61.59 R7.1
PWM7
  Top 0.152: 4.05,53.58 4.13,53.66
  Top 0.203: SERVO_DRIVER.13 4.05,53.58 | 4.13,53.66 R8.1
PWM8
  Top 0.203: R9.1 3.4,29.62 SERVO_DRIVER.15
PWM9
  Top 0.203: SERVO_DRIVER.16 4.05,31.52 15.24,20.32 16.51,20.32 R10.1
PWM10
  Top 0.203: SERVO_DRIVER.17 4.7,32.77 14.61,22.86 19.05,22.86 21.59,20.32 R11.1
PWM11
  Top 0.203: R12.1 25.4,21.59 22.86,24.13 15.24,24.13 5.35,34.02 SERVO_DRIVER.18
PWM12
  Top 0.203: SERVO_DRIVER.19 6,34.65 15.24,25.4 26.04,25.4 29.21,22.23 R14.1
PWM13
  Top 0.152: 6.65,38.26 SERVO_DRIVER.20
  Top 0.203: R13.1 33.02,22.86 28.58,27.3 14.61,27.3 6.65,35.27 6.65,38.26
PWM14
  Top 0.203: R16.1 36.83,22.86 34.61,25.08 34.29,25.4 31.75,27.94 15.24,27.94 7.3,35.88 SERVO_DRIVER.21
PWM15
  Top 0.203: R17.1 40.64,22.86 33.66,29.84 14.61,29.84 7.95,36.51 SERVO_DRIVER.22
R_LED
  Bottom 0.152: TEENSY4.1.20-A6/TX5/LRCLK1 118.11,31.75 116.84,30.48 107.95,30.48 RED.1
RADIO_EN  (via drill 0.35)
  Top 0.152: TEENSY4.1.32-OUT1B v74.93,53.34
  Bottom 0.152: v74.93,53.34 74.93,54.61 81.03,60.71 RADIO.3
RADIO_INT  (via drill 0.35)
  Top 0.152: v78.74,59.69 78.74,54.61 v80.01,53.34
  Bottom 0.152: TEENSY4.1.30-CRX3 v80.01,53.34 | RADIO.4 78.74,60.71 v78.74,59.69
RADIO_RST  (1 unrouted)
  Top 0.152: RADIO.9 80.14,74.81 80.01,74.68 80.01,54.61
RED  (via drill 0.35)  (1 unrouted)
  Top 0.152: RED.2 105.33,19.68 107.27,17.75 107.98,17.75 v109.22,16.51
  Bottom 0.152: v109.22,16.51 110.49,15.24
RX2
  Bottom 0.152: TEENSY4.1.7-RX2/OUT1A 113.03,55.88 123.19,66.04 GPSMTK3339.TX
SCK0  (1 unrouted)
SCL  (via drill 0.35)  (5 unrouted)
  Top 0.152: 131.57,20.57 131.57,12.19 130.81,11.43 NAV.4 | SERVO_DRIVER.26 10.55,39.68 12.78,41.91 v22.86,41.91 67.59,41.91 67.85,41.66 IMU.SCL | BAROMETER.4 131.44,27.3 131.44,29.84 128.91,32.38 117.48,32.38
  Bottom 0.152: 115.57,35.56 110.49,40.64 85.09,40.64 84.07,41.66 IMU.SCL | BAROMETER.4 132.08,23.62
SDA  (via drill 0.35)  (5 unrouted)
  Top 0.152: BAROMETER.3 129.54,29.84 127.64,31.75 115.57,31.75 | SERVO_DRIVER.27 11.2,39.68 12.16,40.64 v25.4,40.64 68.7,40.64 IMU.SDA
  Bottom 0.152: 129.54,23.62 BAROMETER.3 | IMU.SDA 84.03,39.16 85.33,37.86 110.73,37.86 113.03,35.56 | NAV.3 132.72,13.97 133.35,14.61
SELECT_PIN  (via drill 0.35)  (1 unrouted)
  Top 0.152: TEENSY4.1.15-A1/RX3/SPDIF_IN 109.86,29.84 118.75,29.84 121.28,27.3 121.28,19.68 122.81,18.16 v123,18.16
  Bottom 0.152: v123,18.16 127.89,18.16 NAV.2
TX2
  Bottom 0.152: TEENSY4.1.8-TX2/IN1 110.49,64.77 114.3,68.58 GPSMTK3339.RX
W_LED
  Bottom 0.152: TEENSY4.1.22-A8/CTX1 123.19,30.48 121.92,29.21 113.03,29.21 WHITE.1
WHITE  (1 unrouted)
  Bottom 0.152: WHITE.2 115.57,13.97
Y_LED
  Bottom 0.152: TEENSY4.1.21-A7/RX5/BCLK1 120.65,30.79 119.38,29.52 107.95,29.52 YELLOW.1
YELLOW  (1 unrouted)
  Bottom 0.152: YELLOW.2 113.03,13.97

### Text on the board
tPlace: pin29 | pin5 | GND | Pwr | pin6 | pin31 | Signal | pin10 | pin11 | pin12 | pin24 | pin25 | pin10 | pin10 | 5V | GND | SDA | SCL | pin17 | GND | pin16 | Slct Pin | pin13 | SDA | SCL | Signal | Pwr | GND | 5V | DIP1 | DIP2 | DIP3 | DIP4 | GND | Green | Blue | Red | Yllw | White | Orange | PT Sig | GND | 5V